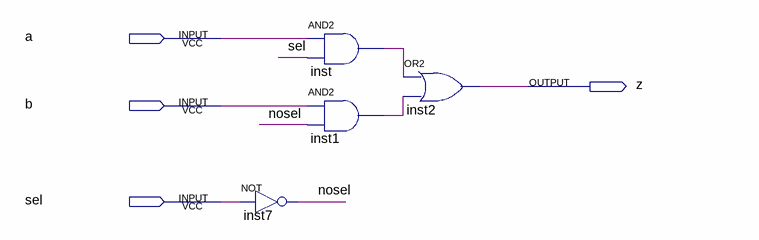
[diagram p0: schematic sheet]
// Quartus schematic MUX_2_to_1.bdf as structural Verilog: 4 symbols, 4 pins
module MUX_2_to_1 (
  input  a,
  input  b,
  input  sel,
  output z
);

  wire inst1_out, inst_out, nosel;

  not inst7 (nosel, sel);
  and inst (inst_out, a, sel);
  and inst1 (inst1_out, b, nosel);
  or inst2 (z, inst_out, inst1_out);
endmodule
